# Altium schematic sheet IO-testing-mezzanine.SchDoc
size A1
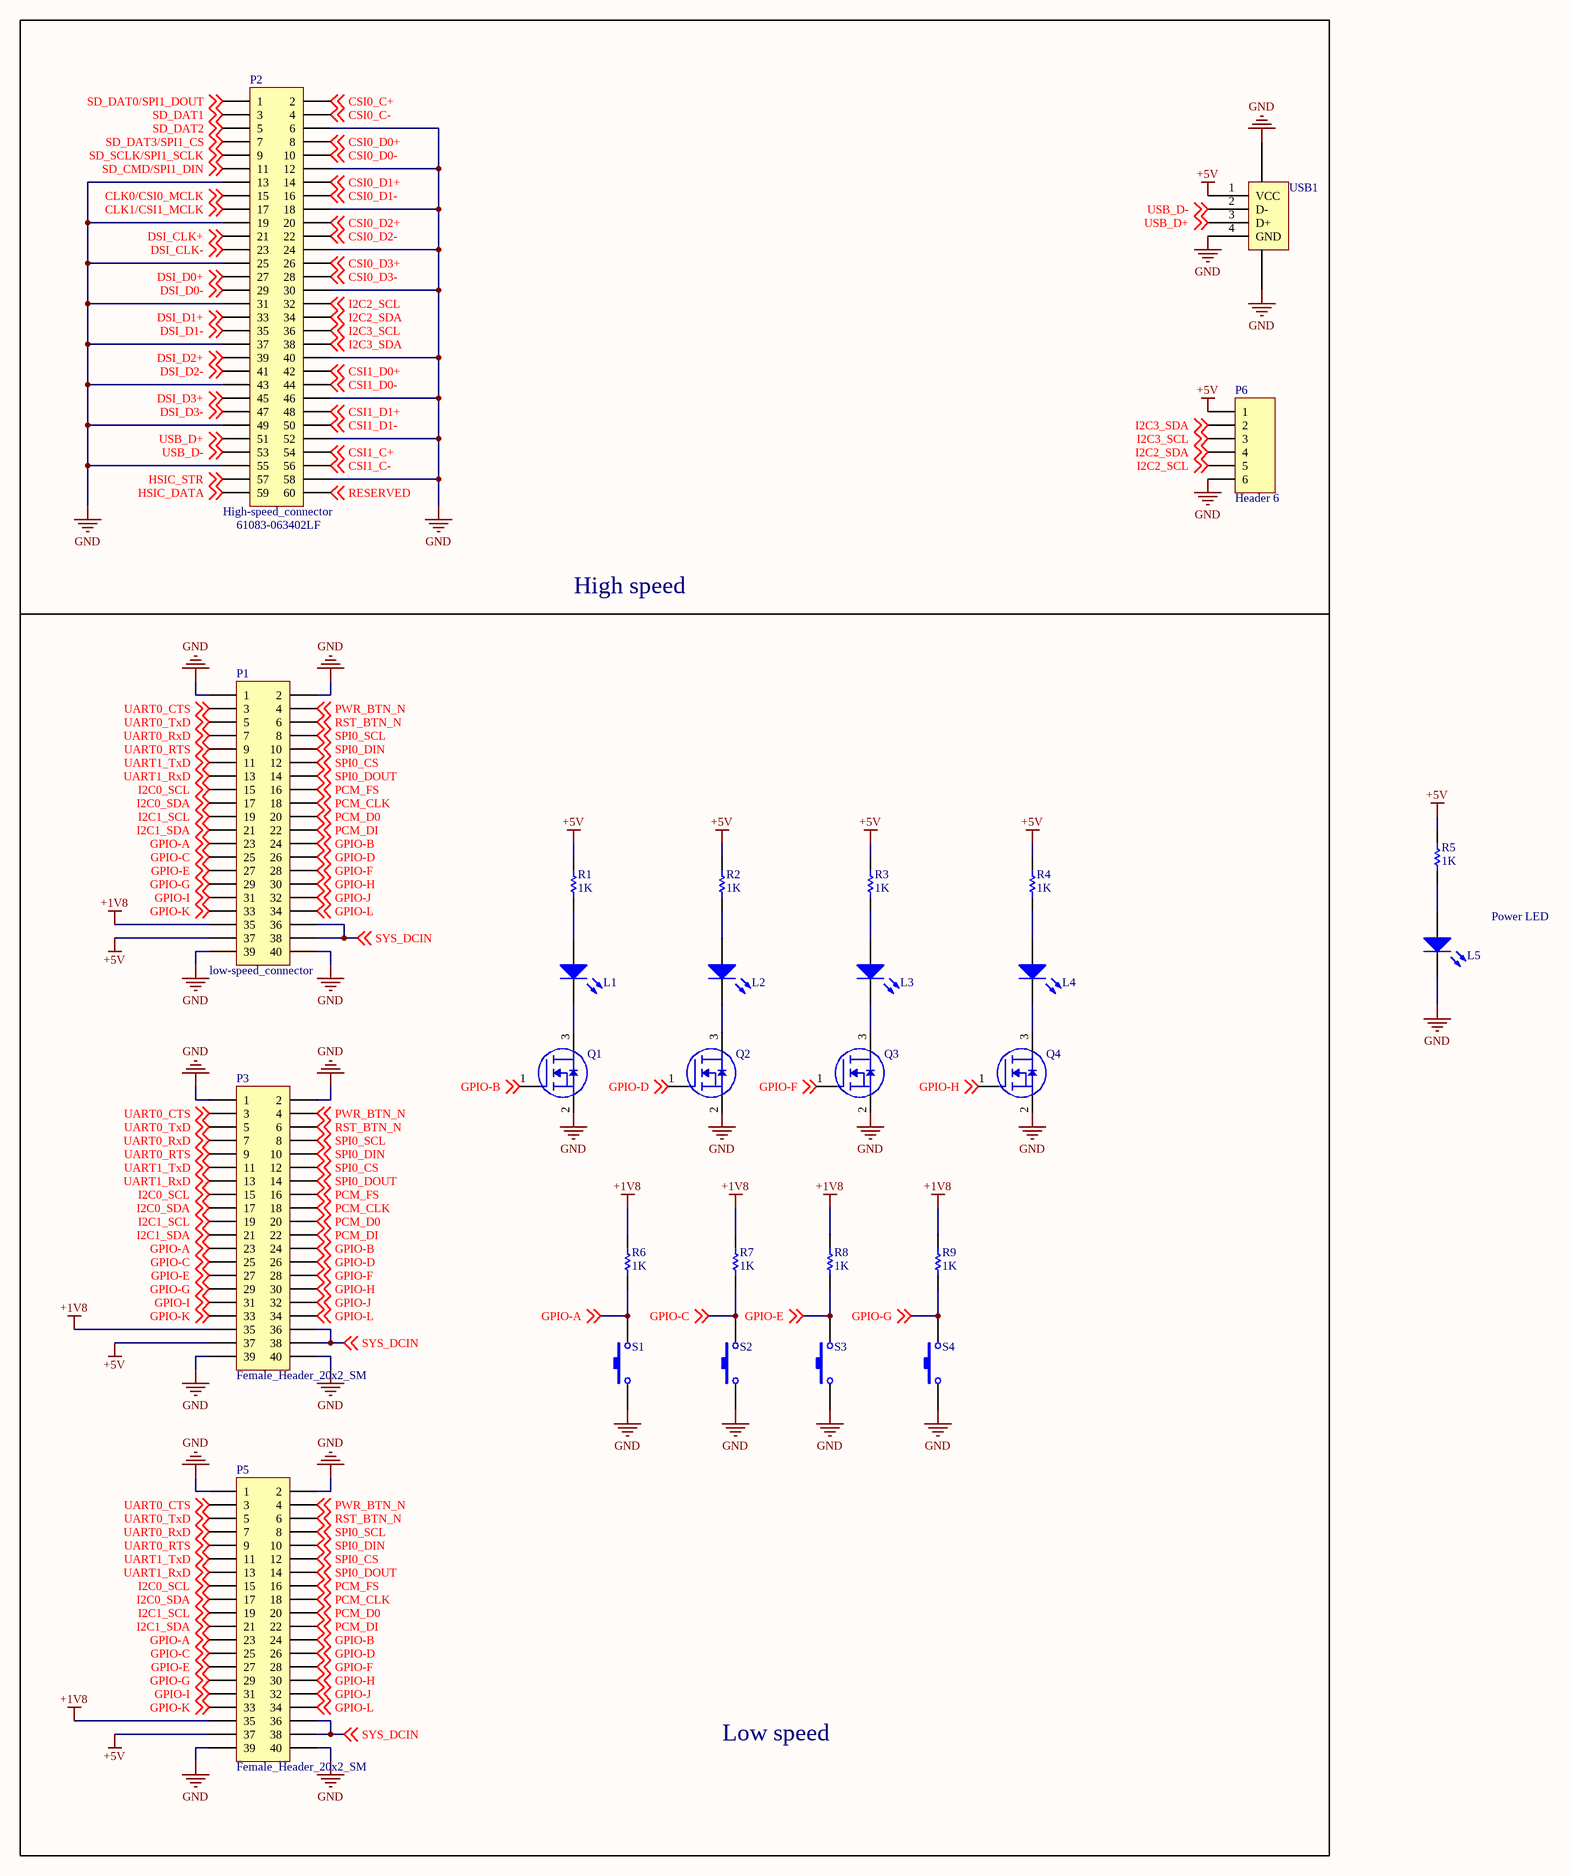
[diagram p0: IO-testing-mezzanine.SchDoc]

## Parts
L1  (no value)  [LED_0603]
L2  (no value)  [LED_0603]
L3  (no value)  [LED_0603]
L4  (no value)  [LED_0603]
L5  (no value)  [LED_0603]
P1  low-speed_connector  [low-speed_connector_SM]
P2  High-speed_connector  PartNumber: 61083-063402LF  [high-speed_connector]
P3  Female_Header_20x2_SM  [Female_Header_20x2_SM]
P5  Female_Header_20x2_SM  [low-speed_connector_SM_top]
P6  Header 6  [HDR1X6]
Q1  RUM002N05T2L  [SOT-723]  (value not drawn)
Q2  RUM002N05T2L  [SOT-723]  (value not drawn)
Q3  RUM002N05T2L  [SOT-723]  (value not drawn)
Q4  RUM002N05T2L  [SOT-723]  (value not drawn)
R1  value 1K  [0603]  (hidden comment: Res1)
R2  value 1K  [0603]  (hidden comment: Res1)
R3  value 1K  [0603]  (hidden comment: Res1)
R4  value 1K  [0603]  (hidden comment: Res1)
R5  value 1K  [0603]  (hidden comment: Res1)
R6  value 1K  [0603]  (hidden comment: Res1)
R7  value 1K  [0603]  (hidden comment: Res1)
R8  value 1K  [0603]  (hidden comment: Res1)
R9  value 1K  [0603]  (hidden comment: Res1)
S1  SW-PB  [SW-PB]  (value not drawn)
S2  SW-PB  [SW-PB]  (value not drawn)
S3  SW-PB  [SW-PB]  (value not drawn)
S4  SW-PB  [SW-PB]  (value not drawn)
USB1  USB  [USB_a]  (value not drawn)

## Nets
+1V8: P1.35 P3.35 P5.35 R6.2 R7.2 R8.2 R9.2
+5V: P1.37 P3.37 P5.37 P6.1 R1.2 R2.2 R3.2 R4.2 R5.2 USB1.1(VCC)
GND: L5.2(K) P1.1 P1.2 P1.39 P1.40 P2.6 P2.12 P2.13 P2.18 P2.19 P2.24 P2.25 P2.30 P2.31 P2.37 P2.40 P2.43 P2.46 P2.49 P2.52 P2.55 P2.58 P3.1 P3.2 P3.39 P3.40 P5.1 P5.2 P5.39 P5.40 P6.6 Q1.2(S) Q2.2(S) Q3.2(S) Q4.2(S) S1.1 S2.1 S3.1 S4.1 USB1.4(GND) USB1.5(GND) USB1.6(GND)
CLK0/CSI0_MCLK: P2.15 ; off-sheet CLK0/CSI0_MCLK
CLK1/CSI1_MCLK: P2.17 ; off-sheet CLK1/CSI1_MCLK
CSI0_C+: P2.2 ; off-sheet CSI0_C+
CSI0_C-: P2.4 ; off-sheet CSI0_C-
CSI0_D0+: P2.8 ; off-sheet CSI0_D0+
CSI0_D0-: P2.10 ; off-sheet CSI0_D0-
CSI0_D1+: P2.14 ; off-sheet CSI0_D1+
CSI0_D1-: P2.16 ; off-sheet CSI0_D1-
CSI0_D2+: P2.20 ; off-sheet CSI0_D2+
CSI0_D2-: P2.22 ; off-sheet CSI0_D2-
CSI0_D3+: P2.26 ; off-sheet CSI0_D3+
CSI0_D3-: P2.28 ; off-sheet CSI0_D3-
CSI1_C+: P2.54 ; off-sheet CSI1_C+
CSI1_C-: P2.56 ; off-sheet CSI1_C-
CSI1_D0+: P2.42 ; off-sheet CSI1_D0+
CSI1_D0-: P2.44 ; off-sheet CSI1_D0-
CSI1_D1+: P2.48 ; off-sheet CSI1_D1+
CSI1_D1-: P2.50 ; off-sheet CSI1_D1-
DSI_CLK+: P2.21 ; off-sheet DSI_CLK+
DSI_CLK-: P2.23 ; off-sheet DSI_CLK-
DSI_D0+: P2.27 ; off-sheet DSI_D0+
DSI_D0-: P2.29 ; off-sheet DSI_D0-
DSI_D1+: P2.33 ; off-sheet DSI_D1+
DSI_D1-: P2.35 ; off-sheet DSI_D1-
DSI_D2+: P2.39 ; off-sheet DSI_D2+
DSI_D2-: P2.41 ; off-sheet DSI_D2-
DSI_D3+: P2.45 ; off-sheet DSI_D3+
DSI_D3-: P2.47 ; off-sheet DSI_D3-
GPIO-A: P1.23 P3.23 P5.23 R6.1 S1.2 ; off-sheet GPIO-A
GPIO-B: P1.24 P3.24 P5.24 Q1.1(G) ; off-sheet GPIO-B
GPIO-C: P1.25 P3.25 P5.25 R7.1 S2.2 ; off-sheet GPIO-C
GPIO-D: P1.26 P3.26 P5.26 Q2.1(G) ; off-sheet GPIO-D
GPIO-E: P1.27 P3.27 P5.27 R8.1 S3.2 ; off-sheet GPIO-E
GPIO-F: P1.28 P3.28 P5.28 Q3.1(G) ; off-sheet GPIO-F
GPIO-G: P1.29 P3.29 P5.29 R9.1 S4.2 ; off-sheet GPIO-G
GPIO-H: P1.30 P3.30 P5.30 Q4.1(G) ; off-sheet GPIO-H
GPIO-I: P1.31 P3.31 P5.31 ; off-sheet GPIO-I
GPIO-J: P1.32 P3.32 P5.32 ; off-sheet GPIO-J
GPIO-K: P1.33 P3.33 P5.33 ; off-sheet GPIO-K
GPIO-L: P1.34 P3.34 P5.34 ; off-sheet GPIO-L
HSIC_DATA: P2.59 ; off-sheet HSIC_DATA
HSIC_STR: P2.39(57) ; off-sheet HSIC_STR
I2C0_SCL: P1.15 P3.15 P5.15 ; off-sheet I2C0_SCL
I2C0_SDA: P1.17 P3.17 P5.17 ; off-sheet I2C0_SDA
I2C1_SCL: P1.19 P3.19 P5.19 ; off-sheet I2C1_SCL
I2C1_SDA: P1.21 P3.21 P5.21 ; off-sheet I2C1_SDA
I2C2_SCL: P2.32 P6.5 ; off-sheet I2C2_SCL
I2C2_SDA: P2.34 P6.4 ; off-sheet I2C2_SDA
I2C3_SCL: P2.36 P6.3 ; off-sheet I2C3_SCL
I2C3_SDA: P2.38 P6.2 ; off-sheet I2C3_SDA
PCM_CLK: P1.18 P3.18 P5.18 ; off-sheet PCM_CLK
PCM_D0: P1.20 P3.20 P5.20 ; off-sheet PCM_D0
PCM_DI: P1.22 P3.22 P5.22 ; off-sheet PCM_DI
PCM_FS: P1.16 P3.16 P5.16 ; off-sheet PCM_FS
PWR_BTN_N: P1.4 P3.4 P5.4 ; off-sheet PWR_BTN_N
RESERVED: P2.38(60) ; off-sheet RESERVED
RST_BTN_N: P1.6 P3.6 P5.6 ; off-sheet RST_BTN_N
SD_CMD/SPI1_DIN: P2.11 ; off-sheet SD_CMD/SPI1_DIN
SD_DAT0/SPI1_DOUT: P2.1 ; off-sheet SD_DAT0/SPI1_DOUT
SD_DAT1: P2.3 ; off-sheet SD_DAT1
SD_DAT2: P2.5 ; off-sheet SD_DAT2
SD_DAT3/SPI1_CS: P2.7 ; off-sheet SD_DAT3/SPI1_CS
SD_SCLK/SPI1_SCLK: P2.9 ; off-sheet SD_SCLK/SPI1_SCLK
SPI0_CS: P1.12 P3.12 P5.12 ; off-sheet SPI0_CS
SPI0_DIN: P1.10 P3.10 P5.10 ; off-sheet SPI0_DIN
SPI0_DOUT: P1.14 P3.14 P5.14 ; off-sheet SPI0_DOUT
SPI0_SCL: P1.8 P3.8 P5.8 ; off-sheet SPI0_SCL
SYS_DCIN: P1.36 P1.38 P3.36 P3.38 P5.36 P5.38 ; off-sheet SYS_DCIN
UART0_CTS: P1.3 P3.3 P5.3 ; off-sheet UART0_CTS
UART0_RTS: P1.9 P3.9 P5.9 ; off-sheet UART0_RTS
UART0_RxD: P1.7 P3.7 P5.7 ; off-sheet UART0_RxD
UART0_TxD: P1.5 P3.5 P5.5 ; off-sheet UART0_TxD
UART1_RxD: P1.13 P3.13 P5.13 ; off-sheet UART1_RxD
UART1_TxD: P1.11 P3.11 P5.11 ; off-sheet UART1_TxD
USB_D+: P2.51 USB1.3(D+) ; off-sheet USB_D+
USB_D-: P2.53 USB1.2(D-) ; off-sheet USB_D-
NetL1_1: L1.1(A) R1.1
NetL1_2: L1.2(K) Q1.3(D)
NetL2_1: L2.1(A) R2.1
NetL2_2: L2.2(K) Q2.3(D)
NetL3_1: L3.1(A) R3.1
NetL3_2: L3.2(K) Q3.3(D)
NetL4_1: L4.1(A) R4.1
NetL4_2: L4.2(K) Q4.3(D)
NetL5_1: L5.1(A) R5.1

## Notes on the sheet
- High speed
- Power LED
- Low speed

## Library data of the parts
L1-L5 = LTST-C193TBKT-5A: LED BLUE CLEAR 0603 SMD; Manufacturer: Lite-On Inc.; Lens Color: Colorless; Millicandela Rating: 15mcd; Lens Style/Size: Rectangle with Flat Top, 1.15mm x 0.80mm; Voltage - Forward (Vf) (Typ): 2.8V; Current - Test: 5mA; Viewing Angle: 130°; Wavelength - Dominant: 470nm; Wavelength - Peak: 468nm; Supplier 1: Digi-Key; Manufacturer Part Number: LTST-C193TBKT-5A; RoHS: RoHS Compliant; Category: Optoelectronics; Stock 1: 456000; Pricing 1: 3000=0.091, 6000=0.0819, 15000=0.0728, 30000=0.06825, 75000=0.06142, 150000=0.05915 (CAD); Packaging: Tape & Reel (TR); Part Status: Active; Color: Blue; Lens Transparency: Clear; Mounting Type: Surface Mount; Features: -; Package / Case: 0603 (1608 Metric); Supplier Device Package: Chip LED; Size / Dimension: 1.60mm L x 0.80mm W; Height (Max): 0.45mm; ComponentLink1URL: http://media.digikey.com/pdf/Data%20Sheets/Lite-On%20PDFs/LTST-C193TBKT-5A.pdf; ComponentLink1Description: http://media.digikey.com/pdf/Data%20Sheets/Lite-On%20PDFs/LTST-C193TBKT-5A.pdf; Supplier Part Number 1: 160-1827-2-ND
P6 = Header 6: Header, 6-Pin; LatestRevisionDate: 17-Jul-2002; LatestRevisionNote: Re-released for DXP Platform.; Publisher: Altium Limited
Q1-Q4 = RUM002N05T2L: Nch 50V 200mA MOSFET; Supplier 1: Digi-Key; Supplier Part Number 1: RUM002N05T2LCT-ND
R1-R9 = Res1: Resistor; PartNumber: RC0603JR-071KL; Published: 8-Jun-2000; LatestRevisionDate: 17-Jul-2002; LatestRevisionNote: Re-released for DXP Platform.; PackageReference: AXIAL-0.3; Publisher: Altium Limited; PackageDescription: Axial Device, Thru-Hole; 2 Leads; 0.3 in Pin Spacing; Supplier 1: Digi-Key; Supplier Part Number 1: 311-1.0KGRTR-ND
S1-S4 = SW-PB: Switch; Manufacturer: C&K; Manufacturer Part Number: KSR223GLFG; Circuit: SPST-NO; Switch Function: Off-Mom; Contact Rating @ Voltage: 0.01A @ 32VDC; Actuator Type: Standard; Actuator Height off PCB, Vertical: 2.50mm; Actuator Orientation: Top Actuated; Outline: 6.00mm x 3.80mm; Illumination: Non-Illuminated; Operating Force: 200gf; Ingress Protection: IP50 - Dust Protected; Actuator Material: Rubber; Switch Travel: 0.30mm; Mechanical Life: 100,000 Cycles; Published: 24-Mar-1999; LatestRevisionDate: 17-Jul-2002; LatestRevisionNote: Re-released for DXP Platform.; PackageReference: SPST-2; Publisher: Altium Limited; PackageDescription: Switch; 2 Leads; Supplier 1: Digi-Key; RoHS: RoHS Compliant; Category: Switches; Stock 1: 37500; Pricing 1: 2500=0.58856, 5000=0.54797 (CAD); Packaging: Tape & Reel (TR); Part Status: Active; Mounting Type: Surface Mount; Actuator Length, Right Angle: -; Termination Style: Gull Wing; Illumination Type, Color: -; Illumination Voltage (Nominal): -; Features: -; Operating Temperature: -40°C ~ 125°C; ComponentLink1URL: http://www.ckswitches.com/media/1466/ksr.pdf; ComponentLink1Description: http://www.ckswitches.com/media/1466/ksr.pdf; Supplier Part Number 1: 401-1704-2-ND; PartNumber: KSR223GLFG
USB1 = USB: PartNumber: USB-A-S-F-W-SM2; Manufacturer: Samtec Inc.; Connector Type: USB - A; Number of Contacts: 4; Gender: Receptacle; Specifications: USB 2.0; Number of Ports: 1; Voltage - Rated: 30VAC; Mating Cycles: 1500; Material Flammability Rating: UL94 V-0; Supplier 1: Digi-Key; Supplier Part Number 1: SAM10368-ND; Manufacturer Part Number: USB-A-S-F-W-SM2; RoHS: RoHS Compliant; Category: Connectors, Interconnects; Stock 1: 264; Pricing 1: 1=2.07, 10=1.871, 25=1.7568, 50=1.6802, 100=1.6038, 250=1.45104, 500=1.33648, 1000=1.14554, 2500=1.06917 (CAD); Packaging: Tray; Part Status: Active; Mounting Type: Surface Mount, Right Angle; Mounting Feature: Horizontal; Termination: Solder; Features: Board Guide, Solder Retention; Ingress Protection: -; Operating Temperature: -50°C ~ 85°C; Current Rating: -; Shielding: -; Contact Finish: Gold; Shell/Shielding Material: Copper Alloy; Insulation Color: White; ComponentLink1URL: http://suddendocs.samtec.com/prints/usb-a-s-x-x-sm2-x-xx-mkt.pdf; ComponentLink1Description: http://suddendocs.samtec.com/prints/usb-a-s-x-x-sm2-x-xx-mkt.pdf
P2 = High-speed_connector: Supplier 1: Digi-Key; Supplier Part Number 1: 609-1679-2-ND
P3 P5 = Female_Header_20x2_SM: Supplier 1: Digi-Key; Supplier Part Number 1: 952-3230-2-ND